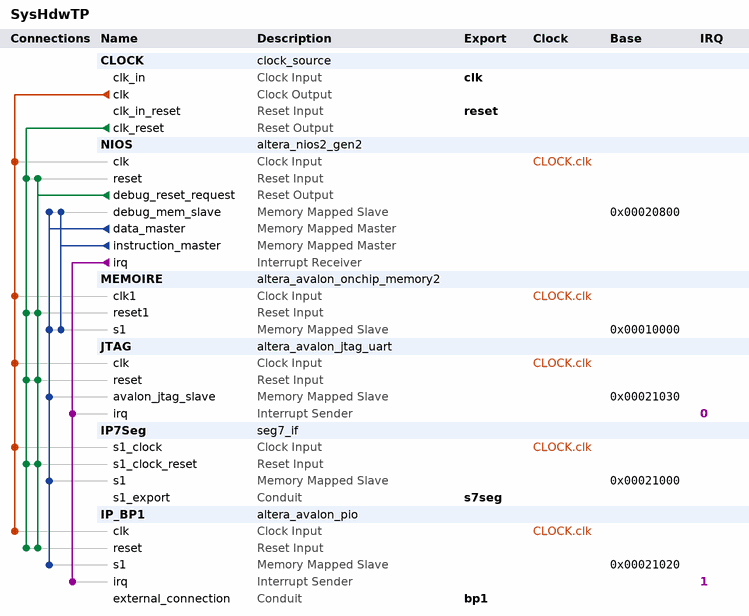
[diagram p0: system contents]
# Platform Designer (Qsys) system SysHdwTP, Cyclone V 5CSXFC6D6F31C6
# Parameters at their usual value, and those the tool derives, are not listed.
package require -exact qsys 18.1
create_system SysHdwTP
set_project_property DEVICE_FAMILY {Cyclone V}
set_project_property DEVICE 5CSXFC6D6F31C6

add_instance CLOCK clock_source 18.1
set_instance_parameter_value CLOCK clockFrequency 50000000

add_instance NIOS altera_nios2_gen2 18.1
set_instance_parameter_value NIOS dcache_size 2048
set_instance_parameter_value NIOS exceptionSlave MEMOIRE.s1
set_instance_parameter_value NIOS icache_size 4096
set_instance_parameter_value NIOS impl Fast
set_instance_parameter_value NIOS resetSlave MEMOIRE.s1

add_instance MEMOIRE altera_avalon_onchip_memory2 18.1
set_instance_parameter_value MEMOIRE dataWidth 32
set_instance_parameter_value MEMOIRE dualPort false
set_instance_parameter_value MEMOIRE initMemContent true
set_instance_parameter_value MEMOIRE initializationFileName onchip_mem.hex
set_instance_parameter_value MEMOIRE memorySize 65536

add_instance JTAG altera_avalon_jtag_uart 18.1
set_instance_parameter_value JTAG simInteractiveOptions NO_INTERACTIVE_WINDOWS

add_instance IP7Seg seg7_if 1.0
set_instance_parameter_value IP7Seg ADDR_WIDTH 3
set_instance_parameter_value IP7Seg DEFAULT_ACTIVE 1
set_instance_parameter_value IP7Seg LOW_ACTIVE 1
set_instance_parameter_value IP7Seg SEG7_NUM 6

add_instance IP_BP1 altera_avalon_pio 18.1
set_instance_parameter_value IP_BP1 captureEdge true
set_instance_parameter_value IP_BP1 direction Input
set_instance_parameter_value IP_BP1 generateIRQ true
set_instance_parameter_value IP_BP1 irqType EDGE
set_instance_parameter_value IP_BP1 width 1

# connections
add_connection CLOCK.clk IP7Seg.s1_clock clock
add_connection CLOCK.clk IP_BP1.clk clock
add_connection CLOCK.clk JTAG.clk clock
add_connection CLOCK.clk MEMOIRE.clk1 clock
add_connection CLOCK.clk NIOS.clk clock
add_connection CLOCK.clk_reset IP7Seg.s1_clock_reset reset
add_connection CLOCK.clk_reset IP_BP1.reset reset
add_connection CLOCK.clk_reset JTAG.reset reset
add_connection CLOCK.clk_reset MEMOIRE.reset1 reset
add_connection CLOCK.clk_reset NIOS.reset reset
add_connection NIOS.debug_reset_request IP7Seg.s1_clock_reset reset
add_connection NIOS.debug_reset_request IP_BP1.reset reset
add_connection NIOS.debug_reset_request JTAG.reset reset
add_connection NIOS.debug_reset_request MEMOIRE.reset1 reset
add_connection NIOS.debug_reset_request NIOS.reset reset
add_connection NIOS.data_master IP7Seg.s1 avalon
set_connection_parameter_value NIOS.data_master/IP7Seg.s1 baseAddress 0x00021000
add_connection NIOS.data_master IP_BP1.s1 avalon
set_connection_parameter_value NIOS.data_master/IP_BP1.s1 baseAddress 0x00021020
add_connection NIOS.data_master JTAG.avalon_jtag_slave avalon
set_connection_parameter_value NIOS.data_master/JTAG.avalon_jtag_slave baseAddress 0x00021030
add_connection NIOS.data_master MEMOIRE.s1 avalon
set_connection_parameter_value NIOS.data_master/MEMOIRE.s1 baseAddress 0x00010000
add_connection NIOS.data_master NIOS.debug_mem_slave avalon
set_connection_parameter_value NIOS.data_master/NIOS.debug_mem_slave baseAddress 0x00020800
add_connection NIOS.instruction_master MEMOIRE.s1 avalon
set_connection_parameter_value NIOS.instruction_master/MEMOIRE.s1 baseAddress 0x00010000
add_connection NIOS.instruction_master NIOS.debug_mem_slave avalon
set_connection_parameter_value NIOS.instruction_master/NIOS.debug_mem_slave baseAddress 0x00020800
add_connection NIOS.irq IP_BP1.irq interrupt
set_connection_parameter_value NIOS.irq/IP_BP1.irq irqNumber 1
add_connection NIOS.irq JTAG.irq interrupt
set_connection_parameter_value NIOS.irq/JTAG.irq irqNumber 0

# exported interfaces
add_interface bp1 conduit end
set_interface_property bp1 EXPORT_OF IP_BP1.external_connection
add_interface clk clock sink
set_interface_property clk EXPORT_OF CLOCK.clk_in
add_interface reset reset sink
set_interface_property reset EXPORT_OF CLOCK.clk_in_reset
add_interface s7seg conduit end
set_interface_property s7seg EXPORT_OF IP7Seg.s1_export

set_interconnect_requirement {$system} qsys_mm.clockCrossingAdapter HANDSHAKE
set_interconnect_requirement {$system} qsys_mm.enableEccProtection FALSE
set_interconnect_requirement {$system} qsys_mm.insertDefaultSlave FALSE
set_interconnect_requirement {$system} qsys_mm.maxAdditionalLatency 1

save_system SysHdwTP.qsys
